# Altium schematic sheet Power.SchDoc
size A4
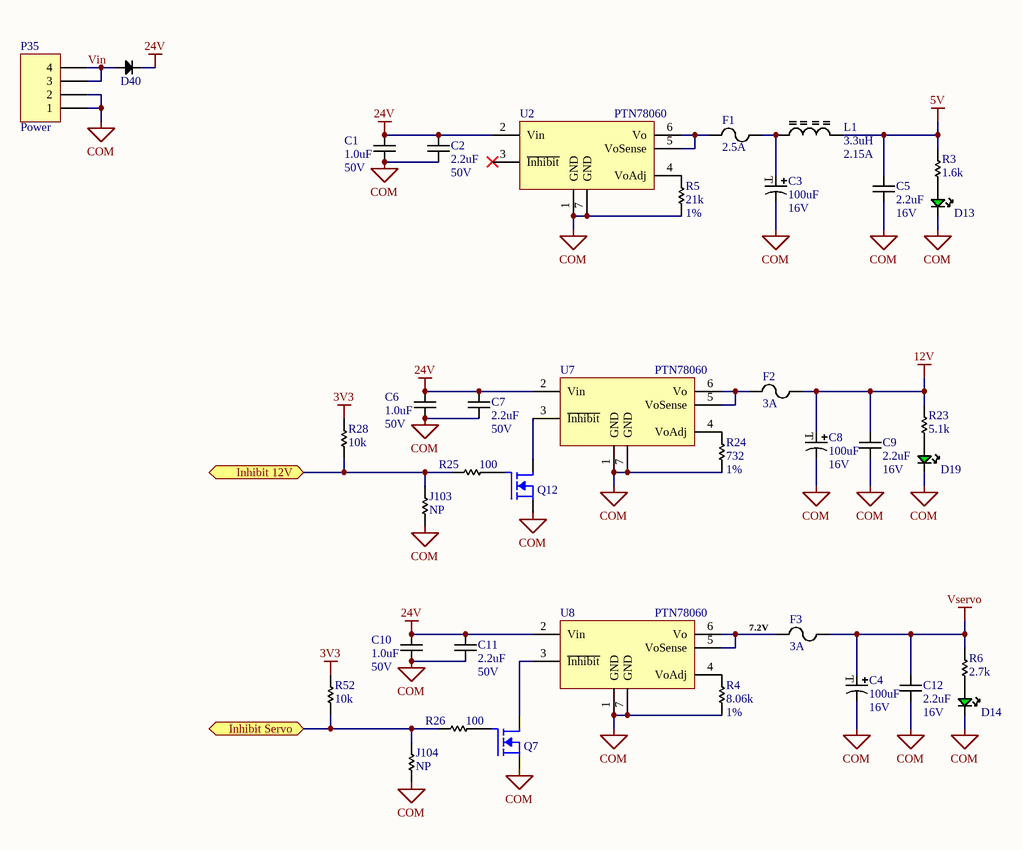
[diagram p0: Power.SchDoc]

## Parts
C1  value 1.0uF  Voltage: 50V  [0805 - Cap Non-Polarized]  (hidden comment: Cap)
C2  value 2.2uF  Voltage: 50V  [0805 - Cap Non-Polarized]  (hidden comment: Cap)
C3  value 100uF  Voltage: 16V  [Tantalum - Case D]  (hidden comment: Cap Tantal)
C4  value 100uF  Voltage: 16V  [Tantalum - Case D]  (hidden comment: Cap Tantal)
C5  value 2.2uF  Voltage: 16V  [0805 - Cap Non-Polarized]  (hidden comment: Cap)
C6  value 1.0uF  Voltage: 50V  [0805 - Cap Non-Polarized]  (hidden comment: Cap)
C7  value 2.2uF  Voltage: 50V  [0805 - Cap Non-Polarized]  (hidden comment: Cap)
C8  value 100uF  Voltage: 16V  [Tantalum - Case D]  (hidden comment: Cap Tantal)
C9  value 2.2uF  Voltage: 16V  [0805 - Cap Non-Polarized]  (hidden comment: Cap)
C10  value 1.0uF  Voltage: 50V  [0805 - Cap Non-Polarized]  (hidden comment: Cap)
C11  value 2.2uF  Voltage: 50V  [0805 - Cap Non-Polarized]  (hidden comment: Cap)
C12  value 2.2uF  Voltage: 16V  [0805 - Cap Non-Polarized]  (hidden comment: Cap)
D13  Green  [0603 - Led Green]  (value not drawn)
D14  Green  [0603 - Led Green]  (value not drawn)
D19  Green  [0603 - Led Green]  (value not drawn)
D40  Diode  [DOS-214AB (SMC)]  (value not drawn)
F1  value 2.5A  [Fuse - 1206]  (hidden comment: Fuse)
F2  value 3A  [Fuse - 1206]  (hidden comment: Fuse)
F3  value 3A  [Fuse - 1206]  (hidden comment: Fuse)
J103  NP  [0805 - Resistor]
J104  NP  [0805 - Resistor]
L1  value 3.3uH  Current: 2.15A  [SRN403]  (hidden comment: Inductor_core)
P35  Power  [OSTOQ045451]
Q7  MOSFET_N  [SOT23-3]  (value not drawn)
Q12  MOSFET_N  [SOT23-3]  (value not drawn)
R3  value 1.6k  [0805 - Resistor]  (hidden comment: Res)
R4  value 8.06k  Tolerance: 1%  [0805 - Resistor]  (hidden comment: Res)
R5  value 21k  Tolerance: 1%  [0805 - Resistor]  (hidden comment: Res)
R6  value 2.7k  [0805 - Resistor]  (hidden comment: Res)
R23  value 5.1k  [0805 - Resistor]  (hidden comment: Res)
R24  value 732  Tolerance: 1%  [0805 - Resistor]  (hidden comment: Res)
R25  value 100  [0805 - Resistor]  (hidden comment: Res)
R26  value 100  [0805 - Resistor]  (hidden comment: Res)
R28  value 10k  [0805 - Resistor]  (hidden comment: Res)
R52  value 10k  [0805 - Resistor]  (hidden comment: Res)
U2  PTN78060  [PTN78060W-THT]
U7  PTN78060  [PTN78060W-THT]
U8  PTN78060  [PTN78060W-THT]

## Ports
Inhibit 12V, Inhibit Servo

## Nets
3V3: R28.1 R52.1
5V: C5.2 L1.2 R3.1
12V: C8.1 C9.2 F2.1 R23.1
24V: C1.1 C2.1 C6.1 C7.1 C10.1 C11.1 D40.2(K) U2.2(Vin) U7.2(Vin) U8.2(Vin)
COM: C1.2 C2.2 C3.2 C4.2 C5.1 C6.2 C7.2 C8.2 C9.1 C10.2 C11.2 C12.1 D13.2(K) D14.2(K) D19.2(K) J103.2 J104.2 P35.1 P35.2 Q7.2(S) Q12.2(S) R4.2 R5.2 R24.1 U2.1(GND) U2.7(GND) U7.1(GND) U7.7(GND) U8.1(GND) U8.7(GND)
Vservo: C4.1 C12.2 F3.1 R6.1
Inhibit 12V: J103.1 R25.2 R28.2 ; port Inhibit 12V
Inhibit Servo: J104.1 R26.2 R52.2 ; port Inhibit Servo
Vin: D40.1(A) P35.3 P35.4
NetC3_1: C3.1 F1.1 L1.1
NetD13_1: D13.1(A) R3.2
NetD14_1: D14.1(A) R6.2
NetD19_1: D19.1(A) R23.2
NetF1_2: F1.2 U2.5(VoSense) U2.6(Vo)
NetF2_2: F2.2 U7.5(VoSense) U7.6(Vo)
NetF3_2: F3.2 U8.5(VoSense) U8.6(Vo)
NetQ7_1: Q7.1(G) R26.1
NetQ7_3: Q7.3(D) U8.3(~{Inhibit})
NetQ12_1: Q12.1(G) R25.1
NetQ12_3: Q12.3(D) U7.3(~{Inhibit})
NetR4_1: R4.1 U8.4(VoAdj)
NetR5_1: R5.1 U2.4(VoAdj)
NetR24_2: R24.2 U7.4(VoAdj)

Not connected (* = marked no-connect by the designer): U2 3(~{Inhibit})*

## Notes on the sheet
- (near F3) 7.2V
- (in symbol Kemet-T491-100uF-16V-700 mOhm) T

## Library data of the parts
C1 C6 C10 = Cap-Samsung-CL-50V-1.0uF-0805-10%: CAP CER 1UF 50V 10% X7R 0805; Manufacturer: Samsung Electro-Mechanics America, Inc; Manufacturer No: CL21B105KBFNNNE; Sub Category: 0805; Part Number: Cap-Samsung-CL-50V-1.0uF-0805-10%; Category: Capacitor; Pin count: 2; Package: 0805; Series: CL; Supplier 1: Digi-Key; Supplier Part Number 1: 1276-1029-1-ND; ComponentLink1URL: http://www.samsungsem.com/servlet/FileDownload?type=spec&file=CL21B105KBFNNNE.pdf; ComponentLink1Description: Datasheet; Creation Date: 2013-11-14 02:22:00; Created by: Pier-Yves; Tolerance: 10%; Height: 1.45mm; Temperature: -55°C ~ 125°C
C2 C7 C11 = Cap-Samsung-CL-50V-2.2uF-0805-10%: CAP CER 2.2UF 50V 10% X5R 0805; Manufacturer: Samsung Electro-Mechanics America, Inc; Manufacturer No: CL21A225KB9LNNC; Sub Category: 0805; Part Number: Cap-Samsung-CL-50V-2.2uF-0805-10%; Category: Capacitor; Pin count: 2; Package: 0805; Series: CL; Supplier 1: Digi-Key; Supplier Part Number 1: 1276-2409-1-ND; ComponentLink1URL: http://www.samsungsem.com/servlet/FileDownload?type=spec&file=CL21A225KB9LNNC.pdf; ComponentLink1Description: Datasheet; Creation Date: 2013-11-14 02:22:00; Created by: Pier-Yves; Tolerance: 10%; Height: 1.45mm; Temperature: -55°C ~ 85°C
C3 C4 C8 = Kemet-T491-100uF-16V-700 mOhm: CAP TANT 100 16V 10% 2917; Manufacturer: Kemet; Manufacturer No: T491D107K016AT; Sub Category: Tantalum; Part Number: Kemet-T491-100uF-16V-700 mOhm; Category: Capacitor; Pin count: 2; Package: 2917; Series: T491; Supplier 1: Digi-Key; Supplier Part Number 1: 399-3770-1-ND; ComponentLink1URL: http://www.kemet.com/datasheets&T491D107K016AT; ComponentLink1Description: Datasheet; Creation Date: 2013-09-15 05:28:18; Created by: Frederic; Tolerance: 10%; Height: 3.10mm; Temperature: -55°C ~ 125°C
C5 C9 C12 = Cap-TDK-CGA-2.2uF-0805: CAP CER 2.2UF 16V 10% X7R 0805; Manufacturer: TDK; Manufacturer No: CGA4J3X7R1C225K125AB; Sub Category: 0805; Part Number: Cap-TDK-CGA-2.2uF-0805; Category: Capacitor; Pin count: 2; Package: 0805; Series: CGA; Supplier 1: Digi-Key; Supplier Part Number 1: 445-5691-1-ND; ComponentLink1URL: http://product.tdk.com/capacitor/mlcc/en/documents/mlcc_automotive_general_en.pdf; ComponentLink1Description: Datasheet; Creation Date: 2013-09-19 19:23:33; Created by: Pier-Yves; Tolerance: 10%; Height: 1.45mm; Temperature: -55°C ~ 125°C
D13 D14 D19 = LED-Green-2mA-lowBrigthness-0603: LED SMARTLED GREEN 570NM 0603; Manufacturer: OSRAM Opto Semiconductor; Manufacturer No: LG L29K-G2J1-24-Z; Sub Category: 0603; Value: 3.92 mcd; Voltage: 1.7V; Current: 2mA; Part Number: LED-Green-2mA-lowBrigthness-0603; Category: LED; Pin count: 2; Package: 0603; Series: SmartLED; Supplier 1: Digi-Key; Supplier Part Number 1: 475-2709-1-ND; ComponentLink1URL: http://catalog.osram-os.com/catalogue/catalogue.do;jsessionid=32CB61882C089EDD4B6D0A54E7E1F117?act=downloadFile&favOid=020000020000138e000100b6; ComponentLink1Description: Datasheet; Creation Date: 2013-11-17 11:13:55; Created by: Pier-Yves; Height: 0.65mm
D40 = MicroCommercial-S10D-TP-10A-1.2V: DIODE GEN PURP 200V 10A DO214AB; Manufacturer: Micro Commercial Co.; Sub Category: Single; Value: 1.2V@10A; Voltage: 1.2V; Part Number: MicroCommercial-S10D-TP-10A-1.2V; Category: Diode; Pin count: 2; Package: SMC; Manufacturer No: S10D-TP; Supplier 1: Digi-Key; Supplier Part Number 1: S10D-TPMSCT-ND; ComponentLink1URL: http://www.mccsemi.com/up_pdf/S10A~S10M(HSMC).PDF; ComponentLink1Description: Datasheet; Creation Date: 2013-11-19 12:36:02; Created by: Pier-Yves; Height: 5.4mm; Current: 10A; Temperature: -55°C ~ 150°C
F1 = Fuse-1206-BelFuse-Fast-C1Q-2.5A: FUSE 2.5A 125V 1206 FAST C1Q; Manufacturer No: C1Q 2.5; Sub Category: 1206 Fastblow; Voltage: 63VDC - 125VAC; Part Number: Fuse-1206-BelFuse-Fast-C1Q-2.5A; Category: Fuse; Pin count: 2; Package: 1206; Manufacturer: Bel Fuse; Series: C1Q; Supplier 1: Digi-Key; Supplier Part Number 1: 507-1081-1-ND; ComponentLink1URL: http://belfuse.com/pdfs/C1Q.pdf; ComponentLink1Description: Datasheet; Creation Date: 2013-11-18 20:12:53; Created by: Pier-Yves; Height: 0.58mm; Current: 2.5A; Temperature: -55°C ~ 125°C
F2 F3 = Fuse-1206-Bourns-Slow-SinglFuse_SF-1206S-3A: FUSE SLOW 32VDC 3A 1206; Manufacturer: Bourns Inc.; Manufacturer No: SF-1206S300-2; Sub Category: 1206 SlowBlow; Voltage: 63VDC; Part Number: Fuse-1206-Bourns-Slow-SinglFuse_SF-1206S-3A; Category: Fuse; Pin count: 2; Package: 1206; Series: SinglFuse SF-1206S; Supplier 1: Digi-Key; Supplier Part Number 1: SF-1206S300-2CT-ND; ComponentLink1URL: http://www.bourns.com/data/global/pdfs/sf1206s.pdf; ComponentLink1Description: Datasheet; Creation Date: 2013-11-18 20:50:29; Created by: Pier-Yves; Height: 0.6mm; Current: 3A; Temperature: -40°C ~ 105°C
J103 J104 = Jumper-0805: RES 0.0 OHM 1/8W JUMP 0805; Manufacturer: Stackpole electronic; Manufacturer No: RMCF0805ZT0R00; Sub Category: 0805; Value: 0; Current: 2A; Part Number: Jumper-0805; Category: Resistor; Pin count: 2; Package: 0805; Series: RMFC; Supplier 1: Digi-Key; Supplier Part Number 1: RMCF0805ZT0R00CT-ND; ComponentLink1URL: http://www.seielect.com/Catalog/SEI-RMCF_RMCP.pdf; ComponentLink1Description: Datasheet; Creation Date: 2013-09-21 02:33:24; Created by: Pier-Yves; Power: 1/8W; Height: 0.65mm
L1 = Ind-Bourns-SRN403-20%-3.3uH: INDUCTOR POWER 3.3UH 2.15A 0403; Manufacturer: Bourns Inc.; Manufacturer No: SDR0403-3R3ML; Tolerance: 20%; Part Number: Ind-Bourns-SRN403-20%-3.3uH; Category: Inductor; Sub Category: SRN403; Pin count: 2; Series: SRN403; Supplier 1: Digi-Key; Supplier Part Number 1: SDR0403-3R3MLCT-ND; ComponentLink1URL: http://www.bourns.com/data/global/pdfs/sdr0403.pdf; ComponentLink1Description: Datasheet; Creation Date: 2013-11-14 02:05:30; Created by: Pier-Yves; Height: 3.2mm; Temperature: -40°C ~ 125°C
P35 = ConnBlock-200mils-RightAngle-THT-4pos: TERM BLOCK HDR 5.08MM 4POS PCB; Voltage: 300V; Current: 20A; LatestRevisionDate: 17-Jul-2002; LatestRevisionNote: Re-released for DXP Platform.; Publisher: Altium Limited; Part Number: ConnBlock-200mils-RightAngle-THT-4pos; Category: Connector; Sub Category: Block; Pin count: 4; Supplier 1: Digi-Key; Supplier Part Number 1: OSTOQ045451; ComponentLink1URL: http://www.on-shore.com/sites/default/files/manuals/ostoqxx5451.pdf; ComponentLink1Description: Datasheet; Creation Date: 2013-11-18 15:44:22; Created by: Pier-Yves; Value: 4 Pos
Q7 Q12 = 2N7002: MosFET Channel-N SOT-23-3 3.3A; Part Number: 2N7002; Manufacturer: Vishay Siliconix; Manufacturer No: SI2304DDS-T1-GE3; Sub Category: MOSFET-N; Value: Channel N; Power: 1.7W; Voltage: 30V; Category: Transistor; Pin count: 3; Package: SOT-23-3; Series: ÉTrenchFET; Supplier 1: Digi-Key; Supplier Part Number 1: SI2304DDS-T1-GE3CT-ND; ComponentLink1URL: http://www.vishay.com/docs/65175/si2304dd.pdf; ComponentLink1Description: Datasheet; Creation Date: 2013-06-28 13:51:31; Created by: Pier-Yves; Current: 3.3A
R3 = Yagao-RC0805-1.6k: RES 1.6K OHM 1/8W 5% 0805 SMD; Manufacturer: Yagao; Manufacturer No: RC0805JR-071K6L; Sub Category: 0805; Part Number: Yagao-RC0805-1.6k; Category: Resistor; Pin count: 2; Package: 0805; Series: RC0805; Supplier 1: Digi-Key; Supplier Part Number 1: 311-1.6KARCT-ND; ComponentLink1URL: http://media.digikey.com/pdf/Data%20Sheets/Yageo%20PDFs/RC0805%20Pb%20Free.pdf; ComponentLink1Description: Datasheet; Creation Date: 2013-06-28 03:21:03; Created by: Pier-Yves; Tolerance: 5%; Power: 1/8W; Height: 0.6mm
R4 = Yagao-RC0805-1%-8.06k: RES 8.06K OHM 1/8W 1% 0805 SMD; Manufacturer: Yagao; Manufacturer No: RC0805FR-078K06L; Part Number: Yagao-RC0805-1%-8.06k; Category: Resistor; Sub Category: 0805 - 1%; Pin count: 2; Package: 0805; Series: RC0805; Supplier 1: Digi-Key; Supplier Part Number 1: 311-8.06KCRCT-ND; ComponentLink1URL: http://media.digikey.com/pdf/Data%20Sheets/Yageo%20PDFs/RC0805%20Pb%20Free.pdf; ComponentLink1Description: Datasheet; Creation Date: 2013-11-05 13:43:35; Created by: Pier-Yves; Power: 1/8W; Height: 0.6mm
R5 = Yagao-RC0805-1%-21k: RES 21.0K OHM 1/8W 1% 0805 SMD; Manufacturer: Yagao; Manufacturer No: RC0805FR-0721KL; Part Number: Yagao-RC0805-1%-21k; Category: Resistor; Sub Category: 0805 - 1%; Pin count: 2; Package: 0805; Series: RC0805; Supplier 1: Digi-Key; Supplier Part Number 1: 311-21.0KCRCT-ND; ComponentLink1URL: http://media.digikey.com/pdf/Data%20Sheets/Yageo%20PDFs/RC0805%20Pb%20Free.pdf; ComponentLink1Description: Datasheet; Creation Date: 2013-11-05 13:43:35; Created by: Pier-Yves; Power: 1/8W; Height: 0.6mm
R6 = Yagao-RC0805-2.7k: RES 2.7K OHM 1/8W 5% 0805 SMD; Manufacturer: Yagao; Manufacturer No: RC0805JR-072K7L; Sub Category: 0805; Part Number: Yagao-RC0805-2.7k; Category: Resistor; Pin count: 2; Package: 0805; Series: RC0805; Supplier 1: Digi-Key; Supplier Part Number 1: 311-2.7KARCT-ND; ComponentLink1URL: http://media.digikey.com/pdf/Data%20Sheets/Yageo%20PDFs/RC0805%20Pb%20Free.pdf; ComponentLink1Description: Datasheet; Creation Date: 2013-06-28 03:21:03; Created by: Pier-Yves; Tolerance: 5%; Power: 1/8W; Height: 0.6mm
R23 = Yagao-RC0805-5.1k: RES 5.1K OHM 1/8W 5% 0805 SMD; Manufacturer: Yagao; Manufacturer No: RC0805JR-075K1L; Sub Category: 0805; Part Number: Yagao-RC0805-5.1k; Category: Resistor; Pin count: 2; Package: 0805; Series: RC0805; Supplier 1: Digi-Key; Supplier Part Number 1: 311-5.1KARCT-ND; ComponentLink1URL: http://media.digikey.com/pdf/Data%20Sheets/Yageo%20PDFs/RC0805%20Pb%20Free.pdf; ComponentLink1Description: Datasheet; Creation Date: 2013-06-28 03:21:03; Created by: Pier-Yves; Tolerance: 5%; Power: 1/8W; Height: 0.6mm
R24 = Yagao-RC0805-1%-732: RES 732 OHM 1/8W 1% 0805 SMD; Manufacturer: Yagao; Manufacturer No: RC0805FR-07732RL; Part Number: Yagao-RC0805-1%-732; Category: Resistor; Sub Category: 0805 - 1%; Pin count: 2; Package: 0805; Series: RC0805; Supplier 1: Digi-Key; Supplier Part Number 1: 311-732CRCT-ND; ComponentLink1URL: http://media.digikey.com/pdf/Data%20Sheets/Yageo%20PDFs/RC0805%20Pb%20Free.pdf; ComponentLink1Description: Datasheet; Creation Date: 2013-11-05 13:43:35; Created by: Pier-Yves; Power: 1/8W; Height: 0.6mm
R25 R26 = Yagao-RC0805-100: RES 100 OHM 1/8W 5% 0805 SMD; Manufacturer: Yagao; Manufacturer No: RC0805JR-07100RL; Sub Category: 0805; Part Number: Yagao-RC0805-100; Category: Resistor; Pin count: 2; Package: 0805; Series: RC0805; Supplier 1: Digi-Key; Supplier Part Number 1: 311-100ARCT-ND; ComponentLink1URL: http://media.digikey.com/pdf/Data%20Sheets/Yageo%20PDFs/RC0805%20Pb%20Free.pdf; ComponentLink1Description: Datasheet; Creation Date: 2013-06-28 03:21:03; Created by: Pier-Yves; Tolerance: 5%; Power: 1/8W; Height: 0.6mm
R28 R52 = Yagao-RC0805-10k: RES 10K OHM 1/8W 5% 0805 SMD; Manufacturer: Yagao; Manufacturer No: RC0805JR-0710KL; Sub Category: 0805; Part Number: Yagao-RC0805-10k; Category: Resistor; Pin count: 2; Package: 0805; Series: RC0805; Supplier 1: Digi-Key; Supplier Part Number 1: 311-10KARCT-ND; ComponentLink1URL: http://media.digikey.com/pdf/Data%20Sheets/Yageo%20PDFs/RC0805%20Pb%20Free.pdf; ComponentLink1Description: Datasheet; Creation Date: 2013-06-28 03:21:03; Created by: Pier-Yves; Tolerance: 5%; Power: 1/8W; Height: 0.6mm
U2 U7 U8 = PTN78060WAH: REG SW 2.5-12.6V 3A HORZ T/H; Manufacturer: Texas Instrument; Sub Category: Buck; Value: 2.5 ~ 12.6 V; Power: 45W; Voltage: 7V ~ 36V; Part Number: PTN78060WAH; Category: DCDC; Pin count: 7; Manufacturer No: PTN78060WAH; Series: PTN78060W; Supplier 1: Digi-Key; Supplier Part Number 1: 296-20523-ND; ComponentLink1URL: http://www.ti.com/lit/ds/symlink/ptn78060h.pdf; ComponentLink1Description: Datasheet; Creation Date: 2013-11-13 23:33:53; Created by: Pier-Yves; Height: 8.9mm; Current: 3A; Temperature: -40°C ~ 85°C